# Altium project Alex_FluidMotionLEDMatrix.PrjPcb
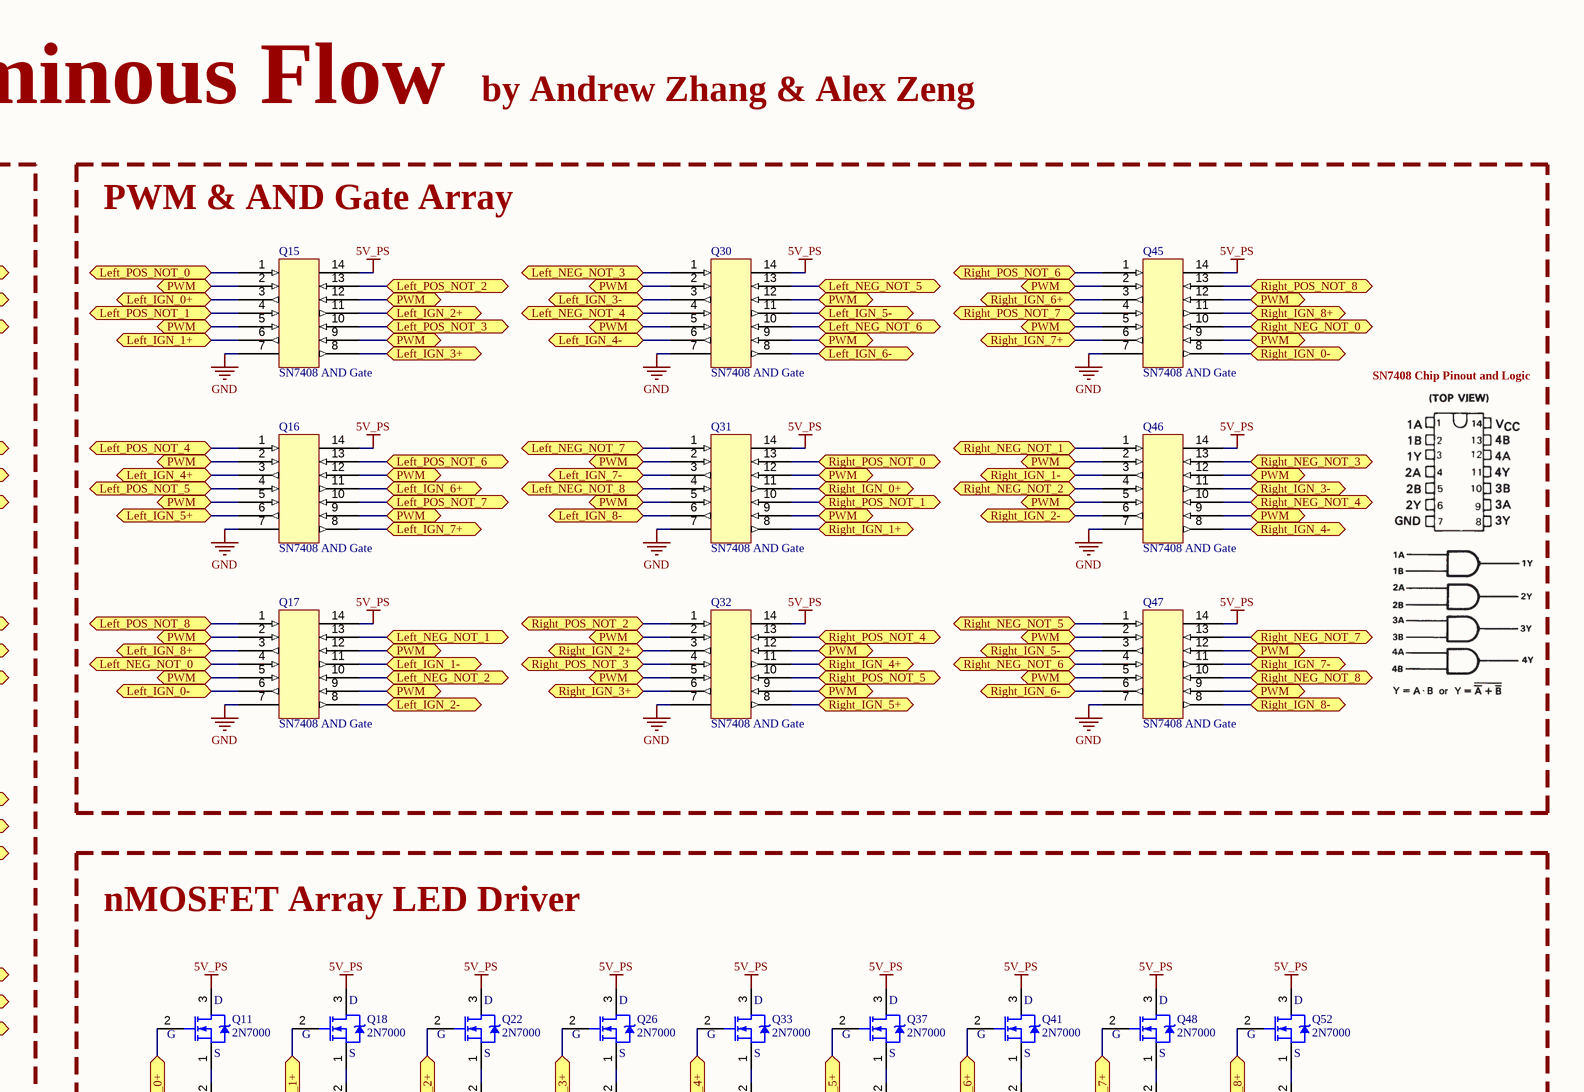
[diagram p0: main.SchDoc, top right]
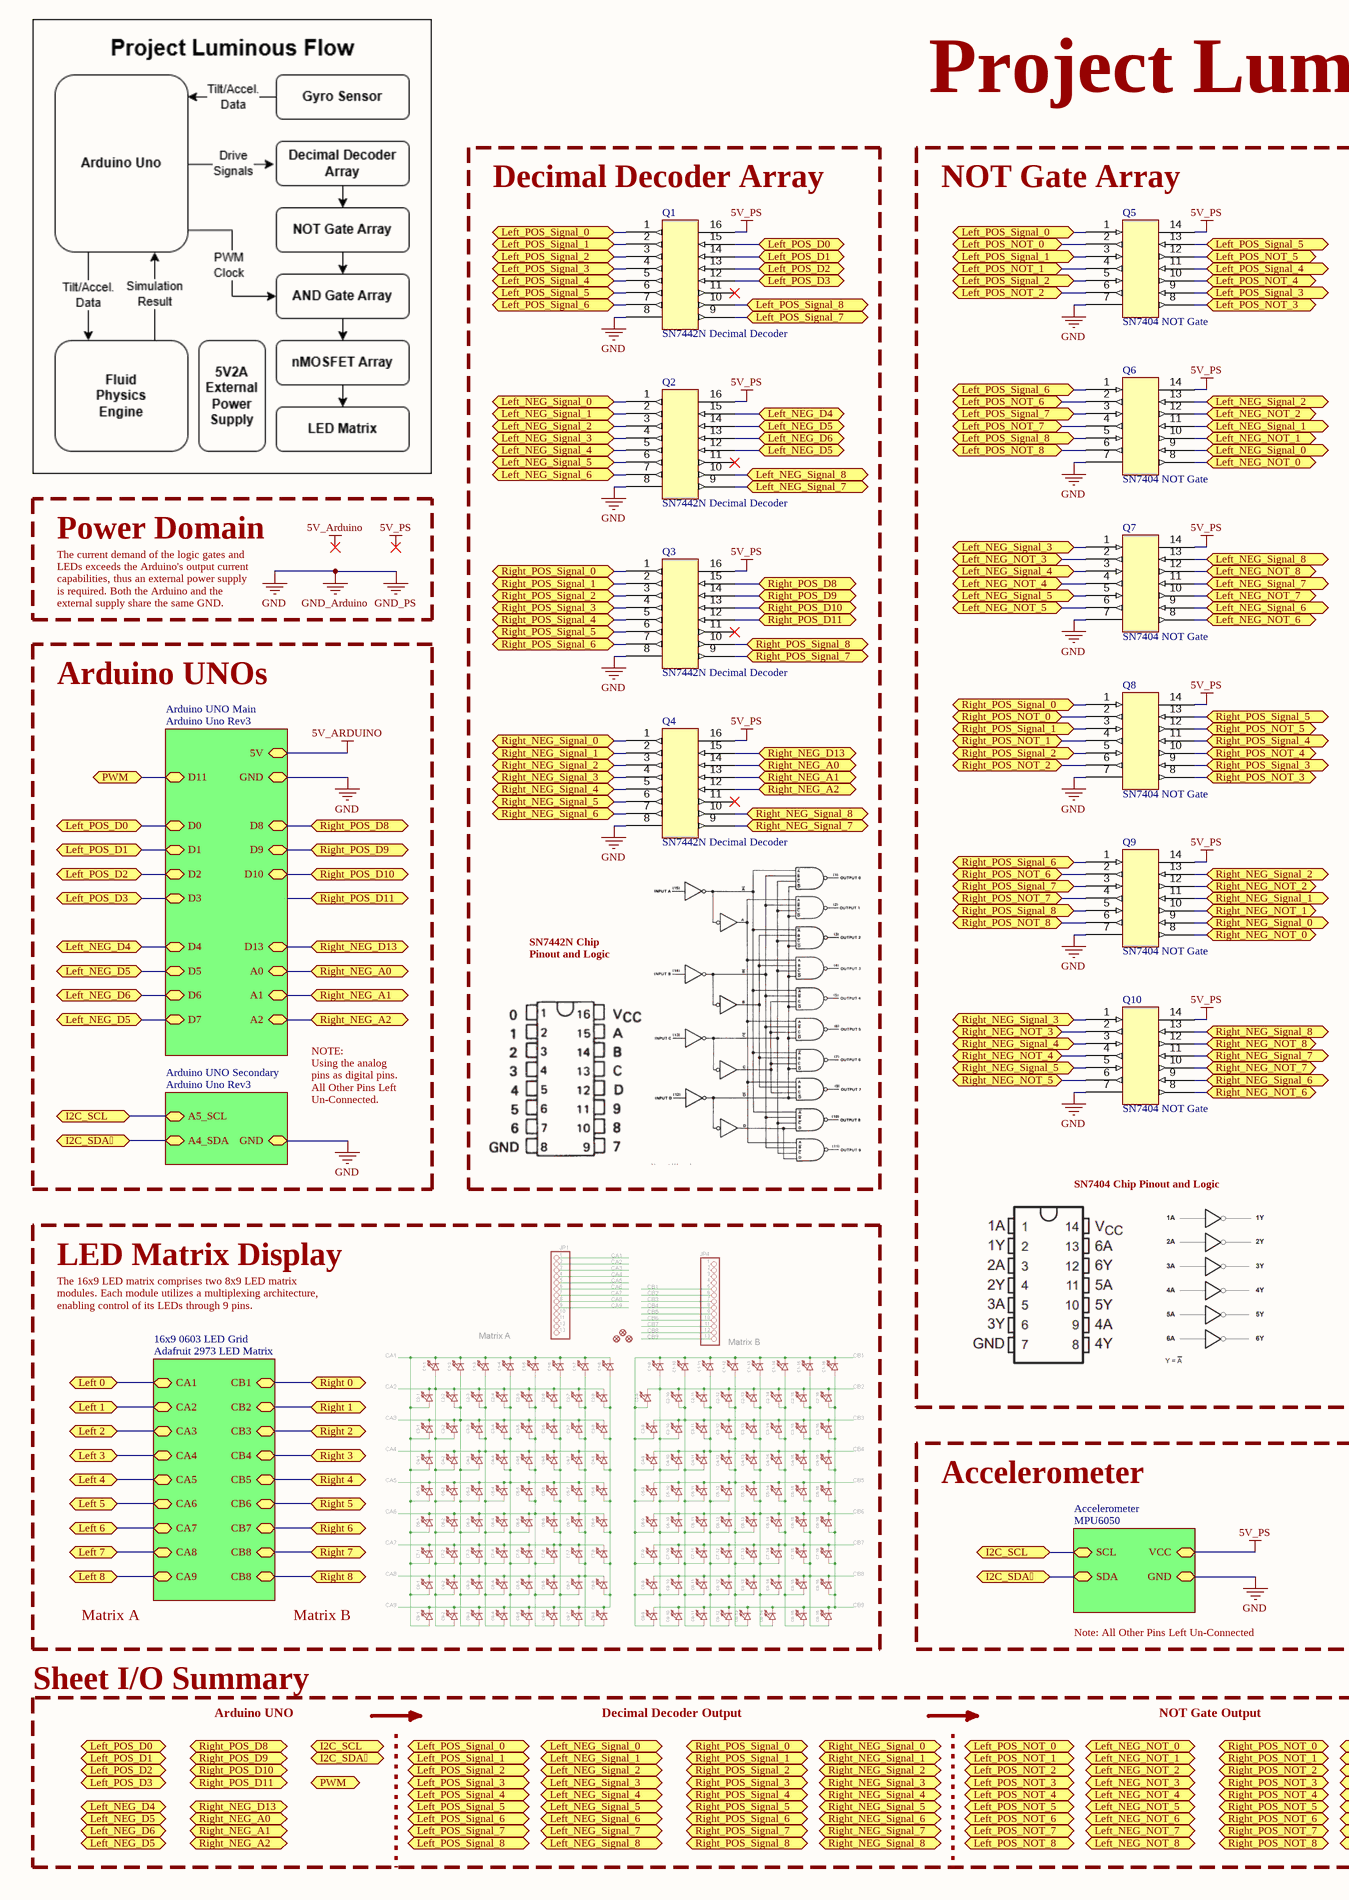
[diagram p1: main.SchDoc, bottom left]
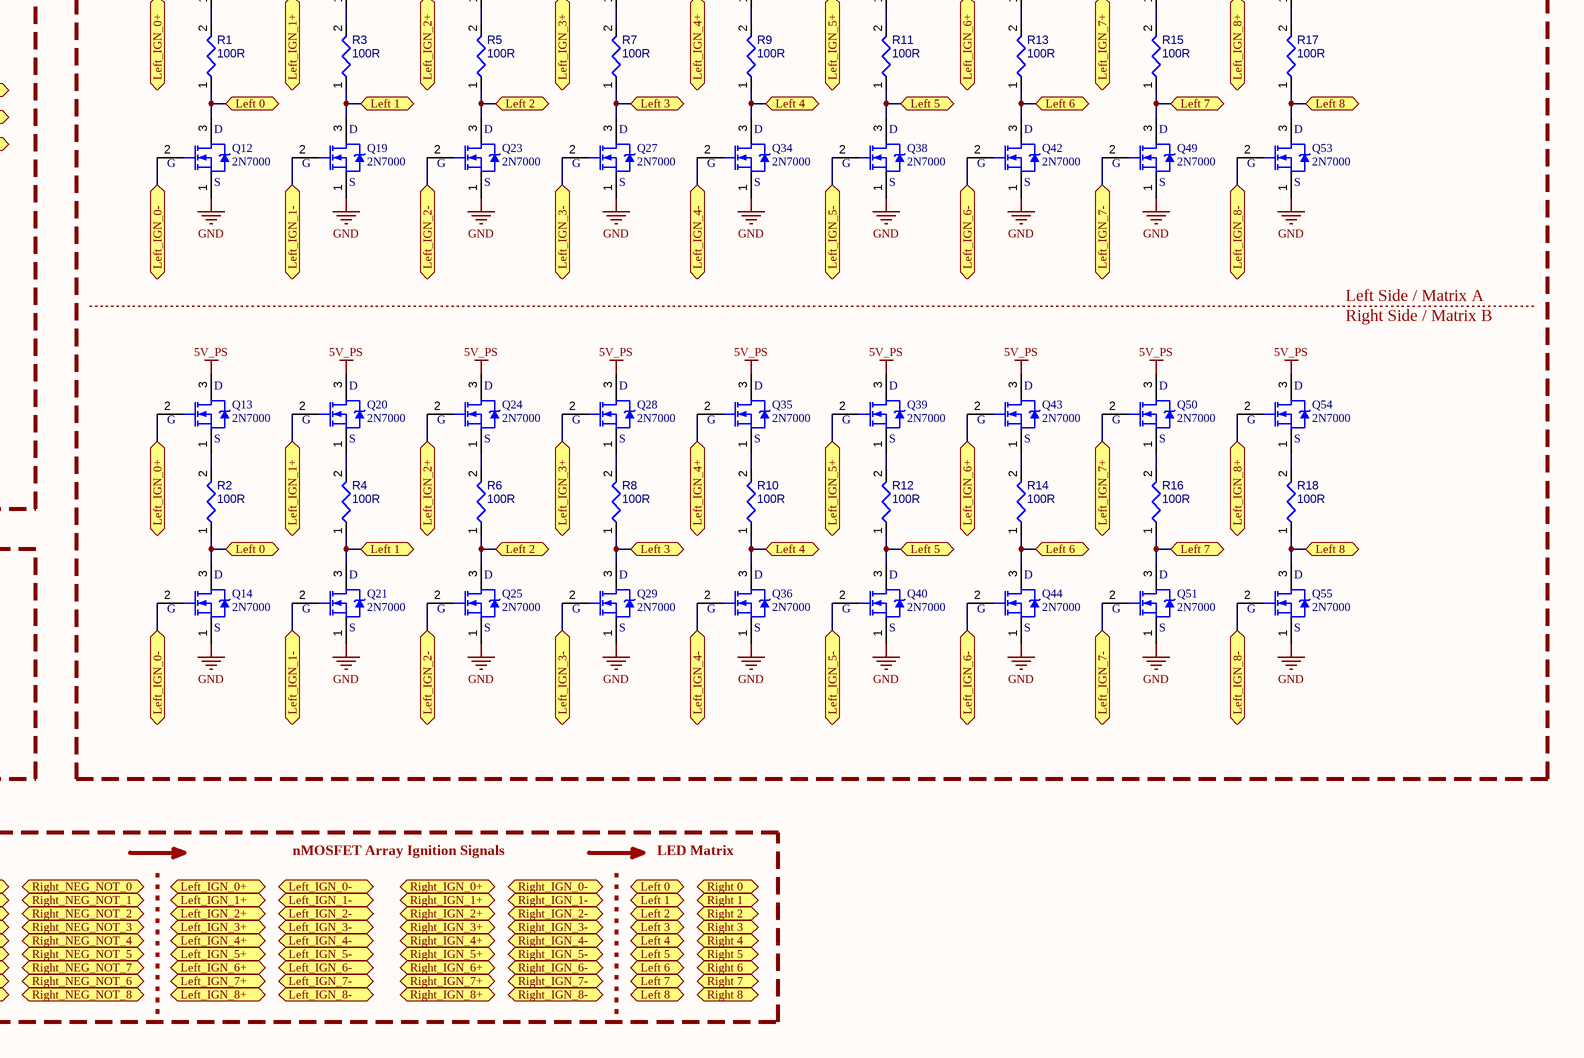
[diagram p2: main.SchDoc, bottom right]
1 sheet, 73 parts. Net scope: hierarchical (ports join the sheet entries above them; power ports are global).

## Sheet main.SchDoc: Project Luminous Flow
size 594 x 420 mm; Author: Andrew Zhang & Alex Zeng; DocumentNumber: 1; Revision: 1; SheetNumber: 1; SheetTotal: 1

### Parts
Q1  SN7442N Decimal Decoder
Q2  SN7442N Decimal Decoder
Q3  SN7442N Decimal Decoder
Q4  SN7442N Decimal Decoder
Q5  SN7404 NOT Gate
Q6  SN7404 NOT Gate
Q7  SN7404 NOT Gate
Q8  SN7404 NOT Gate
Q9  SN7404 NOT Gate
Q10  SN7404 NOT Gate
Q11  2N7000  [ONSC-TO-92-3-29-11_AM_BL]
Q12  2N7000  [ONSC-TO-92-3-29-11_AM_BL]
Q13  2N7000  [ONSC-TO-92-3-29-11_AM_BL]
Q14  2N7000  [ONSC-TO-92-3-29-11_AM_BL]
Q15  SN7408 AND Gate
Q16  SN7408 AND Gate
Q17  SN7408 AND Gate
Q18  2N7000  [ONSC-TO-92-3-29-11_AM_BL]
Q19  2N7000  [ONSC-TO-92-3-29-11_AM_BL]
Q20  2N7000  [ONSC-TO-92-3-29-11_AM_BL]
Q21  2N7000  [ONSC-TO-92-3-29-11_AM_BL]
Q22  2N7000  [ONSC-TO-92-3-29-11_AM_BL]
Q23  2N7000  [ONSC-TO-92-3-29-11_AM_BL]
Q24  2N7000  [ONSC-TO-92-3-29-11_AM_BL]
Q25  2N7000  [ONSC-TO-92-3-29-11_AM_BL]
Q26  2N7000  [ONSC-TO-92-3-29-11_AM_BL]
Q27  2N7000  [ONSC-TO-92-3-29-11_AM_BL]
Q28  2N7000  [ONSC-TO-92-3-29-11_AM_BL]
Q29  2N7000  [ONSC-TO-92-3-29-11_AM_BL]
Q30  SN7408 AND Gate
Q31  SN7408 AND Gate
Q32  SN7408 AND Gate
Q33  2N7000  [ONSC-TO-92-3-29-11_AM_BL]
Q34  2N7000  [ONSC-TO-92-3-29-11_AM_BL]
Q35  2N7000  [ONSC-TO-92-3-29-11_AM_BL]
Q36  2N7000  [ONSC-TO-92-3-29-11_AM_BL]
Q37  2N7000  [ONSC-TO-92-3-29-11_AM_BL]
Q38  2N7000  [ONSC-TO-92-3-29-11_AM_BL]
Q39  2N7000  [ONSC-TO-92-3-29-11_AM_BL]
Q40  2N7000  [ONSC-TO-92-3-29-11_AM_BL]
Q41  2N7000  [ONSC-TO-92-3-29-11_AM_BL]
Q42  2N7000  [ONSC-TO-92-3-29-11_AM_BL]
Q43  2N7000  [ONSC-TO-92-3-29-11_AM_BL]
Q44  2N7000  [ONSC-TO-92-3-29-11_AM_BL]
Q45  SN7408 AND Gate
Q46  SN7408 AND Gate
Q47  SN7408 AND Gate
Q48  2N7000  [ONSC-TO-92-3-29-11_AM_BL]
Q49  2N7000  [ONSC-TO-92-3-29-11_AM_BL]
Q50  2N7000  [ONSC-TO-92-3-29-11_AM_BL]
Q51  2N7000  [ONSC-TO-92-3-29-11_AM_BL]
Q52  2N7000  [ONSC-TO-92-3-29-11_AM_BL]
Q53  2N7000  [ONSC-TO-92-3-29-11_AM_BL]
Q54  2N7000  [ONSC-TO-92-3-29-11_AM_BL]
Q55  2N7000  [ONSC-TO-92-3-29-11_AM_BL]
R1  100R  [RESC0402(1005)_L]
R2  100R  [RESC0402(1005)_L]
R3  100R  [RESC0402(1005)_L]
R4  100R  [RESC0402(1005)_L]
R5  100R  [RESC0402(1005)_L]
R6  100R  [RESC0402(1005)_L]
R7  100R  [RESC0402(1005)_L]
R8  100R  [RESC0402(1005)_L]
R9  100R  [RESC0402(1005)_L]
R10  100R  [RESC0402(1005)_L]
R11  100R  [RESC0402(1005)_L]
R12  100R  [RESC0402(1005)_L]
R13  100R  [RESC0402(1005)_L]
R14  100R  [RESC0402(1005)_L]
R15  100R  [RESC0402(1005)_L]
R16  100R  [RESC0402(1005)_L]
R17  100R  [RESC0402(1005)_L]
R18  100R  [RESC0402(1005)_L]

### Blocks framed on the sheet
Decimal Decoder Array: Q1-Q4
NOT Gate Array: Q5-Q10
PWM & AND Gate Array: Q15-Q17 Q30-Q32 Q45-Q47
nMOSFET Array LED Driver: Q11-Q14 Q18-Q29 Q33-Q44 Q48-Q55 R1-R18

### Sub-sheets
16x9 0603 LED Grid = Adafruit 2973 LED Matrix (file not in this document): CA2 (bidir), CA3 (bidir), CA1 (bidir), CA4 (bidir), CA5 (bidir), CA6 (bidir), CA7 (bidir), CA8 (bidir), CA9 (bidir), CB1 (bidir), CB2 (bidir), CB3 (bidir), CB4 (bidir), CB5 (bidir), CB6 (bidir), CB7 (bidir), CB8 (bidir), CB8 (bidir)
Accelerometer = MPU6050 (file not in this document): VCC (bidir), GND (bidir), SCL (bidir), SDA (bidir)
Arduino UNO Main = Arduino Uno Rev3 (file not in this document): GND (bidir), D1 (bidir), D2 (bidir), D3 (bidir), D4 (bidir), D5 (bidir), D6 (bidir), D7 (bidir), D8 (bidir), D9 (bidir), D10 (bidir), D13 (bidir), A0 (bidir), A1 (bidir), A2 (bidir), D0 (bidir), D11 (bidir), 5V (bidir)
Arduino UNO Secondary = Arduino Uno Rev3 (file not in this document): A5_SCL (bidir), A4_SDA (bidir), GND (bidir)

### Ports
I2C_SCL (bidir), I2C_SDA (bidir), Left 0 (bidir), Left 1 (bidir), Left 2 (bidir), Left 3 (bidir), Left 4 (bidir), Left 5 (bidir), Left 6 (bidir), Left 7 (bidir), Left 8 (bidir), Left_IGN_0+ (bidir), Left_IGN_0- (bidir), Left_IGN_1+ (bidir), Left_IGN_1- (bidir), Left_IGN_2+ (bidir), Left_IGN_2- (bidir), Left_IGN_3+ (bidir), Left_IGN_3- (bidir), Left_IGN_4+ (bidir), Left_IGN_4- (bidir), Left_IGN_5+ (bidir), Left_IGN_5- (bidir), Left_IGN_6+ (bidir), Left_IGN_6- (bidir), Left_IGN_7+ (bidir), Left_IGN_7- (bidir), Left_IGN_8+ (bidir), Left_IGN_8- (bidir), Left_NEG_D4 (bidir), Left_NEG_D5 (bidir), Left_NEG_D6 (bidir), Left_NEG_NOT_0 (bidir), Left_NEG_NOT_1 (bidir), Left_NEG_NOT_2 (bidir), Left_NEG_NOT_3 (bidir), Left_NEG_NOT_4 (bidir), Left_NEG_NOT_5 (bidir), Left_NEG_NOT_6 (bidir), Left_NEG_NOT_7 (bidir), Left_NEG_NOT_8 (bidir), Left_NEG_Signal_0 (bidir), Left_NEG_Signal_1 (bidir), Left_NEG_Signal_2 (bidir), Left_NEG_Signal_3 (bidir), Left_NEG_Signal_4 (bidir), Left_NEG_Signal_5 (bidir), Left_NEG_Signal_6 (bidir), Left_NEG_Signal_7 (bidir), Left_NEG_Signal_8 (bidir), Left_POS_D0 (bidir), Left_POS_D1 (bidir), Left_POS_D2 (bidir), Left_POS_D3 (bidir), Left_POS_NOT_0 (bidir), Left_POS_NOT_1 (bidir), Left_POS_NOT_2 (bidir), Left_POS_NOT_3 (bidir), Left_POS_NOT_4 (bidir), Left_POS_NOT_5 (bidir), Left_POS_NOT_6 (bidir), Left_POS_NOT_7 (bidir), Left_POS_NOT_8 (bidir), Left_POS_Signal_0 (bidir), Left_POS_Signal_1 (bidir), Left_POS_Signal_2 (bidir), Left_POS_Signal_3 (bidir), Left_POS_Signal_4 (bidir), Left_POS_Signal_5 (bidir), Left_POS_Signal_6 (bidir), Left_POS_Signal_7 (bidir), Left_POS_Signal_8 (bidir), PWM (bidir), Right 0 (bidir), Right 1 (bidir), Right 2 (bidir), Right 3 (bidir), Right 4 (bidir), Right 5 (bidir), Right 6 (bidir), Right 7 (bidir), Right 8 (bidir), Right_IGN_0+ (bidir), Right_IGN_0- (bidir), Right_IGN_1+ (bidir), Right_IGN_1- (bidir), Right_IGN_2+ (bidir), Right_IGN_2- (bidir), Right_IGN_3+ (bidir), Right_IGN_3- (bidir), Right_IGN_4+ (bidir), Right_IGN_4- (bidir), Right_IGN_5+ (bidir), Right_IGN_5- (bidir), Right_IGN_6+ (bidir), Right_IGN_6- (bidir), Right_IGN_7+ (bidir), Right_IGN_7- (bidir), Right_IGN_8+ (bidir), Right_IGN_8- (bidir), Right_NEG_A0 (bidir), Right_NEG_A1 (bidir), Right_NEG_A2 (bidir), Right_NEG_D13 (bidir), Right_NEG_NOT_0 (bidir), Right_NEG_NOT_1 (bidir), Right_NEG_NOT_2 (bidir), Right_NEG_NOT_3 (bidir), Right_NEG_NOT_4 (bidir), Right_NEG_NOT_5 (bidir), Right_NEG_NOT_6 (bidir), Right_NEG_NOT_7 (bidir), Right_NEG_NOT_8 (bidir), Right_NEG_Signal_0 (bidir), Right_NEG_Signal_1 (bidir), Right_NEG_Signal_2 (bidir), Right_NEG_Signal_3 (bidir), Right_NEG_Signal_4 (bidir), Right_NEG_Signal_5 (bidir), Right_NEG_Signal_6 (bidir), Right_NEG_Signal_7 (bidir), Right_NEG_Signal_8 (bidir), Right_POS_D8 (bidir), Right_POS_D9 (bidir), Right_POS_D10 (bidir), Right_POS_D11 (bidir), Right_POS_NOT_0 (bidir), Right_POS_NOT_1 (bidir), Right_POS_NOT_2 (bidir), Right_POS_NOT_3 (bidir), Right_POS_NOT_4 (bidir), Right_POS_NOT_5 (bidir), Right_POS_NOT_6 (bidir), Right_POS_NOT_7 (bidir), Right_POS_NOT_8 (bidir), Right_POS_Signal_0 (bidir), Right_POS_Signal_1 (bidir), Right_POS_Signal_2 (bidir), Right_POS_Signal_3 (bidir), Right_POS_Signal_4 (bidir), Right_POS_Signal_5 (bidir), Right_POS_Signal_6 (bidir), Right_POS_Signal_7 (bidir), Right_POS_Signal_8 (bidir)

### Nets
5V_Arduino: sheet Arduino UNO Main/5V
5V_PS: Q1.16 Q2.16 Q3.16 Q4.16 Q5.14 Q6.14 Q7.14 Q8.14 Q9.14 Q10.14 Q11.3(D) Q13.3(D) Q15.14 Q16.14 Q17.14 Q18.3(D) Q20.3(D) Q22.3(D) Q24.3(D) Q26.3(D) Q28.3(D) Q30.14 Q31.14 Q32.14 Q33.3(D) Q35.3(D) Q37.3(D) Q39.3(D) Q41.3(D) Q43.3(D) Q45.14 Q46.14 Q47.14 Q48.3(D) Q50.3(D) Q52.3(D) Q54.3(D) ; sheet Accelerometer/VCC
GND: Q1.8 Q2.8 Q3.8 Q4.8 Q5.7 Q6.7 Q7.7 Q8.7 Q9.7 Q10.7 Q12.1(S) Q14.1(S) Q15.7 Q16.7 Q17.7 Q19.1(S) Q21.1(S) Q23.1(S) Q25.1(S) Q27.1(S) Q29.1(S) Q30.7 Q31.7 Q32.7 Q34.1(S) Q36.1(S) Q38.1(S) Q40.1(S) Q42.1(S) Q44.1(S) Q45.7 Q46.7 Q47.7 Q49.1(S) Q51.1(S) Q53.1(S) Q55.1(S) ; sheet Arduino UNO Main/GND, sheet Accelerometer/GND, sheet Arduino UNO Secondary/GND  [also labelled GND_Arduino, GND_PS]
NetQ1_1: Q1.1 Q5.1 ; port Left_POS_Signal_0
NetQ1_2: Q1.2 Q5.3 ; port Left_POS_Signal_1
NetQ1_3: Q1.3 Q5.5 ; port Left_POS_Signal_2
NetQ1_4: Q1.4 Q5.9 ; port Left_POS_Signal_3
NetQ1_5: Q1.5 Q5.11 ; port Left_POS_Signal_4
NetQ1_6: Q1.6 Q5.13 ; port Left_POS_Signal_5
NetQ1_7: Q1.7 Q6.1 ; port Left_POS_Signal_6
NetQ1_9: Q1.9 Q6.3 ; port Left_POS_Signal_7
NetQ1_10: Q1.10 Q6.5 ; port Left_POS_Signal_8
NetQ1_12: Q1.12 ; port Left_POS_D3, sheet Arduino UNO Main/D3
NetQ1_13: Q1.13 ; port Left_POS_D2, sheet Arduino UNO Main/D2
NetQ1_14: Q1.14 ; port Left_POS_D1, sheet Arduino UNO Main/D1
NetQ1_15: Q1.15 ; port Left_POS_D0, sheet Arduino UNO Main/D0
NetQ2_1: Q2.1 Q6.9 ; port Left_NEG_Signal_0
NetQ2_2: Q2.2 Q6.11 ; port Left_NEG_Signal_1
NetQ2_3: Q2.3 Q6.13 ; port Left_NEG_Signal_2
NetQ2_4: Q2.4 Q7.1 ; port Left_NEG_Signal_3
NetQ2_5: Q2.5 Q7.3 ; port Left_NEG_Signal_4
NetQ2_6: Q2.6 Q7.5 ; port Left_NEG_Signal_5
NetQ2_7: Q2.7 Q7.9 ; port Left_NEG_Signal_6
NetQ2_9: Q2.9 Q7.11 ; port Left_NEG_Signal_7
NetQ2_10: Q2.10 Q7.13 ; port Left_NEG_Signal_8
NetQ2_12: Q2.12 Q2.14 ; port Left_NEG_D5, sheet Arduino UNO Main/D5, sheet Arduino UNO Main/D7
NetQ2_13: Q2.13 ; port Left_NEG_D6, sheet Arduino UNO Main/D6
NetQ2_15: Q2.15 ; port Left_NEG_D4, sheet Arduino UNO Main/D4
NetQ3_1: Q3.1 Q8.1 ; port Right_POS_Signal_0
NetQ3_2: Q3.2 Q8.3 ; port Right_POS_Signal_1
NetQ3_3: Q3.3 Q8.5 ; port Right_POS_Signal_2
NetQ3_4: Q3.4 Q8.9 ; port Right_POS_Signal_3
NetQ3_5: Q3.5 Q8.11 ; port Right_POS_Signal_4
NetQ3_6: Q3.6 Q8.13 ; port Right_POS_Signal_5
NetQ3_7: Q3.7 Q9.1 ; port Right_POS_Signal_6
NetQ3_9: Q3.9 Q9.3 ; port Right_POS_Signal_7
NetQ3_10: Q3.10 Q9.5 ; port Right_POS_Signal_8
NetQ3_12: Q3.12 ; port Right_POS_D11
NetQ3_13: Q3.13 ; port Right_POS_D10, sheet Arduino UNO Main/D10
NetQ3_14: Q3.14 ; port Right_POS_D9, sheet Arduino UNO Main/D9
NetQ3_15: Q3.15 ; port Right_POS_D8, sheet Arduino UNO Main/D8
NetQ4_1: Q4.1 Q9.9 ; port Right_NEG_Signal_0
NetQ4_2: Q4.2 Q9.11 ; port Right_NEG_Signal_1
NetQ4_3: Q4.3 Q9.13 ; port Right_NEG_Signal_2
NetQ4_4: Q4.4 Q10.1 ; port Right_NEG_Signal_3
NetQ4_5: Q4.5 Q10.3 ; port Right_NEG_Signal_4
NetQ4_6: Q4.6 Q10.5 ; port Right_NEG_Signal_5
NetQ4_7: Q4.7 Q10.9 ; port Right_NEG_Signal_6
NetQ4_9: Q4.9 Q10.11 ; port Right_NEG_Signal_7
NetQ4_10: Q4.10 Q10.13 ; port Right_NEG_Signal_8
NetQ4_12: Q4.12 ; port Right_NEG_A2, sheet Arduino UNO Main/A2
NetQ4_13: Q4.13 ; port Right_NEG_A1, sheet Arduino UNO Main/A1
NetQ4_14: Q4.14 ; port Right_NEG_A0, sheet Arduino UNO Main/A0
NetQ4_15: Q4.15 ; port Right_NEG_D13, sheet Arduino UNO Main/D13
NetQ5_2: Q5.2 Q15.1 ; port Left_POS_NOT_0
NetQ5_4: Q5.4 Q15.4 ; port Left_POS_NOT_1
NetQ5_6: Q5.6 Q15.13 ; port Left_POS_NOT_2
NetQ5_8: Q5.8 Q15.10 ; port Left_POS_NOT_3
NetQ5_10: Q5.10 Q16.1 ; port Left_POS_NOT_4
NetQ5_12: Q5.12 Q16.4 ; port Left_POS_NOT_5
NetQ6_2: Q6.2 Q16.13 ; port Left_POS_NOT_6
NetQ6_4: Q6.4 Q16.10 ; port Left_POS_NOT_7
NetQ6_6: Q6.6 Q17.1 ; port Left_POS_NOT_8
NetQ6_8: Q6.8 Q17.4 ; port Left_NEG_NOT_0
NetQ6_10: Q6.10 Q17.13 ; port Left_NEG_NOT_1
NetQ6_12: Q6.12 Q17.10 ; port Left_NEG_NOT_2
NetQ7_2: Q7.2 Q30.1 ; port Left_NEG_NOT_3
NetQ7_4: Q7.4 Q30.4 ; port Left_NEG_NOT_4
NetQ7_6: Q7.6 Q30.13 ; port Left_NEG_NOT_5
NetQ7_8: Q7.8 Q30.10 ; port Left_NEG_NOT_6
NetQ7_10: Q7.10 Q31.1 ; port Left_NEG_NOT_7
NetQ7_12: Q7.12 Q31.4 ; port Left_NEG_NOT_8
NetQ8_2: Q8.2 Q31.13 ; port Right_POS_NOT_0
NetQ8_4: Q8.4 Q31.10 ; port Right_POS_NOT_1
NetQ8_6: Q8.6 Q32.1 ; port Right_POS_NOT_2
NetQ8_8: Q8.8 Q32.4 ; port Right_POS_NOT_3
NetQ8_10: Q8.10 Q32.13 ; port Right_POS_NOT_4
NetQ8_12: Q8.12 Q32.10 ; port Right_POS_NOT_5
NetQ9_2: Q9.2 Q45.1 ; port Right_POS_NOT_6
NetQ9_4: Q9.4 Q45.4 ; port Right_POS_NOT_7
NetQ9_6: Q9.6 Q45.13 ; port Right_POS_NOT_8
NetQ9_8: Q9.8 Q45.10 ; port Right_NEG_NOT_0
NetQ9_10: Q9.10 Q46.1 ; port Right_NEG_NOT_1
NetQ9_12: Q9.12 Q46.4 ; port Right_NEG_NOT_2
NetQ10_2: Q10.2 Q46.13 ; port Right_NEG_NOT_3
NetQ10_4: Q10.4 Q46.10 ; port Right_NEG_NOT_4
NetQ10_6: Q10.6 Q47.1 ; port Right_NEG_NOT_5
NetQ10_8: Q10.8 Q47.4 ; port Right_NEG_NOT_6
NetQ10_10: Q10.10 Q47.13 ; port Right_NEG_NOT_7
NetQ10_12: Q10.12 Q47.10 ; port Right_NEG_NOT_8
NetQ11_1: Q11.1(S) R1.2
NetQ11_2: Q11.2(G) Q13.2(G) Q15.3 ; port Left_IGN_0+
NetQ12_2: Q12.2(G) Q14.2(G) Q17.6 ; port Left_IGN_0-
NetQ12_3: Q12.3(D) Q14.3(D) R1.1 R2.1 ; port Left 0, sheet 16x9 0603 LED Grid/CA1
NetQ13_1: Q13.1(S) R2.2
NetQ15_2: Q15.2 Q15.5 Q15.9 Q15.12 Q16.2 Q16.5 Q16.9 Q16.12 Q17.2 Q17.5 Q17.9 Q17.12 Q30.2 Q30.5 Q30.9 Q30.12 Q31.2 Q31.5 Q31.9 Q31.12 Q32.2 Q32.5 Q32.9 Q32.12 Q45.2 Q45.5 Q45.9 Q45.12 Q46.2 Q46.5 Q46.9 Q46.12 Q47.2 Q47.5 Q47.9 Q47.12 ; port PWM, sheet Arduino UNO Main/D11
NetQ15_6: Q15.6 Q18.2(G) Q20.2(G) ; port Left_IGN_1+
NetQ15_8: Q15.8 Q26.2(G) Q28.2(G) ; port Left_IGN_3+
NetQ15_11: Q15.11 Q22.2(G) Q24.2(G) ; port Left_IGN_2+
NetQ16_3: Q16.3 Q33.2(G) Q35.2(G) ; port Left_IGN_4+
NetQ16_6: Q16.6 Q37.2(G) Q39.2(G) ; port Left_IGN_5+
NetQ16_8: Q16.8 Q48.2(G) Q50.2(G) ; port Left_IGN_7+
NetQ16_11: Q16.11 Q41.2(G) Q43.2(G) ; port Left_IGN_6+
NetQ17_3: Q17.3 Q52.2(G) Q54.2(G) ; port Left_IGN_8+
NetQ17_8: Q17.8 Q23.2(G) Q25.2(G) ; port Left_IGN_2-
NetQ17_11: Q17.11 Q19.2(G) Q21.2(G) ; port Left_IGN_1-
NetQ18_1: Q18.1(S) R3.2
NetQ19_3: Q19.3(D) Q21.3(D) R3.1 R4.1 ; port Left 1, sheet 16x9 0603 LED Grid/CA2
NetQ20_1: Q20.1(S) R4.2
NetQ22_1: Q22.1(S) R5.2
NetQ23_3: Q23.3(D) Q25.3(D) R5.1 R6.1 ; port Left 2, sheet 16x9 0603 LED Grid/CA3
NetQ24_1: Q24.1(S) R6.2
NetQ26_1: Q26.1(S) R7.2
NetQ27_2: Q27.2(G) Q29.2(G) Q30.3 ; port Left_IGN_3-
NetQ27_3: Q27.3(D) Q29.3(D) R7.1 R8.1 ; port Left 3, sheet 16x9 0603 LED Grid/CA4
NetQ28_1: Q28.1(S) R8.2
NetQ30_6: Q30.6 Q34.2(G) Q36.2(G) ; port Left_IGN_4-
NetQ30_8: Q30.8 Q42.2(G) Q44.2(G) ; port Left_IGN_6-
NetQ30_11: Q30.11 Q38.2(G) Q40.2(G) ; port Left_IGN_5-
NetQ31_3: Q31.3 Q49.2(G) Q51.2(G) ; port Left_IGN_7-
NetQ31_6: Q31.6 Q53.2(G) Q55.2(G) ; port Left_IGN_8-
NetQ31_8: Q31.8 ; port Right_IGN_1+
NetQ31_11: Q31.11 ; port Right_IGN_0+
NetQ32_3: Q32.3 ; port Right_IGN_2+
NetQ32_6: Q32.6 ; port Right_IGN_3+
NetQ32_8: Q32.8 ; port Right_IGN_5+
NetQ32_11: Q32.11 ; port Right_IGN_4+
NetQ33_1: Q33.1(S) R9.2
NetQ34_3: Q34.3(D) Q36.3(D) R9.1 R10.1 ; port Left 4, sheet 16x9 0603 LED Grid/CA5
NetQ35_1: Q35.1(S) R10.2
NetQ37_1: Q37.1(S) R11.2
NetQ38_3: Q38.3(D) Q40.3(D) R11.1 R12.1 ; port Left 5, sheet 16x9 0603 LED Grid/CA6
NetQ39_1: Q39.1(S) R12.2
NetQ41_1: Q41.1(S) R13.2
NetQ42_3: Q42.3(D) Q44.3(D) R13.1 R14.1 ; port Left 6, sheet 16x9 0603 LED Grid/CA7
NetQ43_1: Q43.1(S) R14.2
NetQ45_3: Q45.3 ; port Right_IGN_6+
NetQ45_6: Q45.6 ; port Right_IGN_7+
NetQ45_8: Q45.8 ; port Right_IGN_0-
NetQ45_11: Q45.11 ; port Right_IGN_8+
NetQ46_3: Q46.3 ; port Right_IGN_1-
NetQ46_6: Q46.6 ; port Right_IGN_2-
NetQ46_8: Q46.8 ; port Right_IGN_4-
NetQ46_11: Q46.11 ; port Right_IGN_3-
NetQ47_3: Q47.3 ; port Right_IGN_5-
NetQ47_6: Q47.6 ; port Right_IGN_6-
NetQ47_8: Q47.8 ; port Right_IGN_8-
NetQ47_11: Q47.11 ; port Right_IGN_7-
NetQ48_1: Q48.1(S) R15.2
NetQ49_3: Q49.3(D) Q51.3(D) R15.1 R16.1 ; port Left 7, sheet 16x9 0603 LED Grid/CA8
NetQ50_1: Q50.1(S) R16.2
NetQ52_1: Q52.1(S) R17.2
NetQ53_3: Q53.3(D) Q55.3(D) R17.1 R18.1 ; port Left 8, sheet 16x9 0603 LED Grid/CA9
NetQ54_1: Q54.1(S) R18.2
(unnamed): port Right 0, sheet 16x9 0603 LED Grid/CB1
(unnamed): port Right 1, sheet 16x9 0603 LED Grid/CB2
(unnamed): port Right 2, sheet 16x9 0603 LED Grid/CB3
(unnamed): port Right 3, sheet 16x9 0603 LED Grid/CB4
(unnamed): port Right 4, sheet 16x9 0603 LED Grid/CB5
(unnamed): port Right 5, sheet 16x9 0603 LED Grid/CB6
(unnamed): port Right 6, sheet 16x9 0603 LED Grid/CB7
(unnamed): port Right 7, sheet 16x9 0603 LED Grid/CB8
(unnamed): port Right 8, sheet 16x9 0603 LED Grid/CB8
(unnamed): port I2C_SCL, sheet Accelerometer/SCL, sheet Arduino UNO Secondary/A5_SCL
(unnamed): port I2C_SDA, sheet Accelerometer/SDA, sheet Arduino UNO Secondary/A4_SDA

Not connected (* = marked no-connect by the designer): Q1 11*; Q2 11*; Q3 11*; Q4 11*

### Notes on the sheet
- Project Luminous Flow
- by Andrew Zhang & Alex Zeng
- SN7408 Chip Pinout and Logic
- Power Domain
- The current demand of the logic gates and LEDs exceeds the Arduino's output current capabilities, thus an external power supply is required. Both the Arduino and the external supply share the same GND.
- Arduino UNOs
- (near Q11) D
- (near Q18) D
- (near Q22) D
- (near Q26) D
- (near Q33) D
- (near Q37) D
- (near Q41) D
- (near Q48) D
- (near Q52) D
- SN7442N Chip Pinout and Logic
- (near Q11) G
- (near Q11) S
- (near Q18) G
- (near Q18) S
- (near Q22) G
- (near Q22) S
- (near Q26) G
- (near Q26) S
- (near Q33) G
- (near Q33) S
- (near Q37) G
- (near Q37) S
- (near Q41) G
- (near Q41) S
- (near Q48) G
- (near Q48) S
- (near Q52) G
- (near Q52) S
- (near Q12) D
- (near Q19) D
- (near Q23) D
- (near Q27) D
- (near Q34) D
- (near Q38) D
- (near Q42) D
- (near Q49) D
- (near Q53) D
- NOTE:
  Using the analog pins as digital pins.
  All Other Pins Left Un-Connected.
- (near Q12) G
- (near Q12) S
- (near Q19) G
- (near Q19) S
- (near Q23) G
- (near Q23) S
- (near Q27) G
- (near Q27) S
- (near Q34) G
- (near Q34) S
- (near Q38) G
- (near Q38) S
- (near Q42) G
- (near Q42) S
- (near Q49) G
- (near Q49) S
- (near Q53) G
- (near Q53) S
- SN7404 Chip Pinout and Logic
- LED Matrix Display
- Left Side / Matrix A
- Right Side / Matrix B
- The 16x9 LED matrix comprises two 8x9 LED matrix modules. Each module utilizes a multiplexing architecture, enabling control of its LEDs through 9 pins.
- (near Q13) G
- (near Q13) D
- (near Q20) G
- (near Q20) D
- (near Q24) G
- (near Q24) D
- (near Q28) G
- (near Q28) D
- (near Q35) G
- (near Q35) D
- (near Q39) G
- (near Q39) D
- (near Q43) G
- (near Q43) D
- (near Q50) G
- (near Q50) D
- (near Q54) G
- (near Q54) D
- (near Q13) S
- (near Q20) S
- (near Q24) S
- (near Q28) S
- (near Q35) S
- (near Q39) S
- (near Q43) S
- (near Q50) S
- (near Q54) S
- Accelerometer
- (near Q14) G
- (near Q14) S
- (near Q14) D
- (near Q21) G
- (near Q21) S
- (near Q21) D
- (near Q25) G
- (near Q25) S
- (near Q25) D
- (near Q29) G
- (near Q29) S
- (near Q29) D
- (near Q36) G
- (near Q36) S
- (near Q36) D
- (near Q40) G
- (near Q40) S
- (near Q40) D
- (near Q44) G
- (near Q44) S
- (near Q44) D
- (near Q51) G
- (near Q51) S
- (near Q51) D
- (near Q55) G
- (near Q55) S
- (near Q55) D
- Matrix A
- Matrix B
- Note: All Other Pins Left Un-Connected
- Sheet I/O Summary
- Arduino UNO
- Decimal Decoder Output
- NOT Gate Output
- nMOSFET Array Ignition Signals
- LED Matrix
- Labels drawn without touching a wire or pin: 5V_Arduino, 5V_PS
- DWG NO:
- REV:
- THIS DOCUMENT AND THE DATA DISCLOSED HEREIN OR
- HEREWITH IS THE PROPERTY OF ALTIUM LIMITED AND MAY
- BE FREELY DISTRIBUTED IN WHOLE. NO RIGHTS ARE
- RESERVED OR EXPRESS OR IMPLIED WARANTEE GIVEN.
- REVISION
- DESCRIPTION
- DATE
- APPROVED
- ENG:
- APPROVALS
- PROJECT
- DSN:
- CHK:
- REFERENCE DOCUMENTS
- PROJECT REVISION:
- TITLE
- DOCUMENT REVISION:
- DESIGN ITEM:
- BOM:
- FAB DWG:
- PCB DWG:
- ASSY DWG:
- SCALE:
- A2
- SIZE
- CAGE CODE
- FILE NAME
- DWG NO.
- SHEET
- OF
- REV

### Library data of the parts
Q1-Q4 = CMP-016-00010-1: 10-line Decimal Decoder
Q5-Q10 = CMP-016-00011-1
Q11-Q14 Q18-Q29 Q33-Q44 Q48-Q55 = CMP-013-00020-4: Small Signal MOSFET, 200 mA, 60 V, N-Channel, 3-Pin TO-92, Bulk Box; Manufacturer: Fairchild Semiconductor; Input Capacitance: 50pF; Power: 400mW; Rds On Max: 5Ohm; Nominal Dual Supply Voltage: 60V; Elements: 1; Package Version: Rev. AM; Nominal Vgs: 2.1V; RoHS Compliant: True; Mounting Technology: TH; Max Operating Temperature: 150°C; Package Quantity: 2000; Package Reference: TO-92-3-29-11_AM_BL; Datasheet Version: Rev. 8, 04/2011; Package Description: 3-Pin Transistor Outline, Body 4.825 x 3.685 mm, Pitch 1.27 mm; Packaging: Bulk; Min Operating Temperature: -55°C; Case/Package: TO-92; Datasheet URL: http://www.onsemi.com/pub_link/Collateral/2N7000-D.PDF; Pins: 3
Q15-Q17 Q30-Q32 Q45-Q47 = CMP-00030-00003-1: Quad 2-input Positive-AND gates 14-PDIP 0 to 70
R1-R18 = CMP-009-00065-2: Tolerance: 1%; Power: 63mW; Value: 100; Case/Package: 0402; Pins: 2; Mounting Technology: SMT